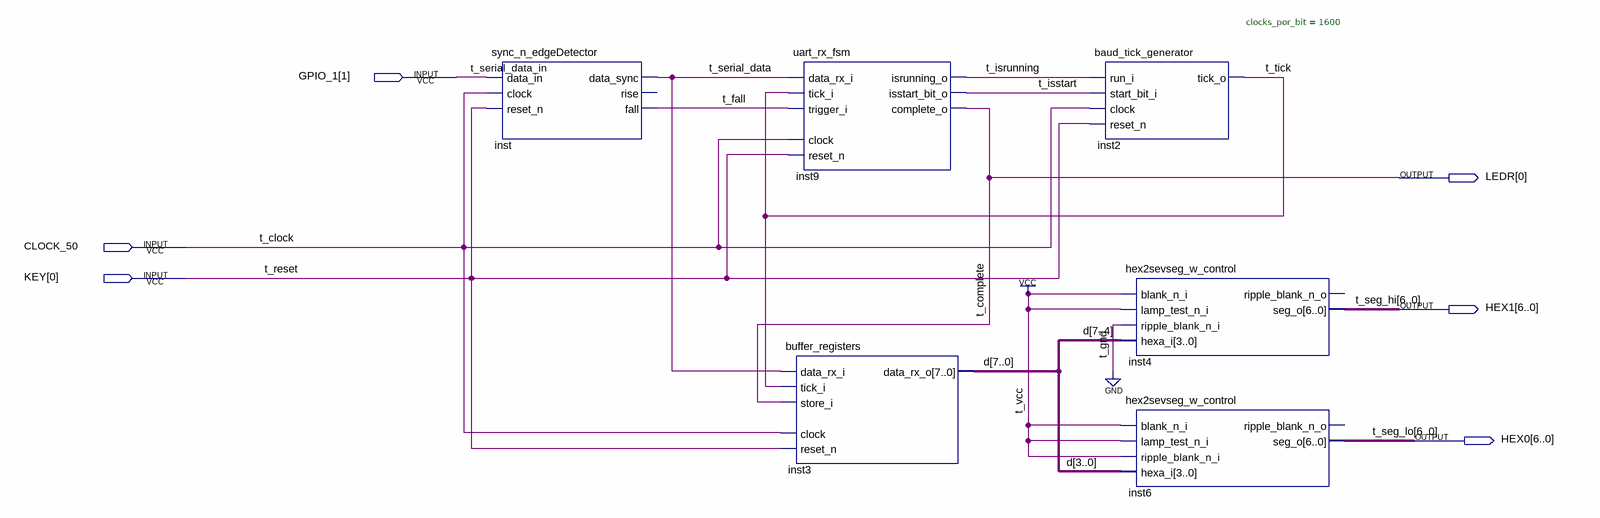
[diagram p0: schematic sheet]
// Quartus schematic UART_RX.bdf as structural Verilog: 6 symbols, 6 pins
module UART_RX (
  input  [1:1] GPIO_1,
  input  CLOCK_50,
  input  [0:0] KEY,
  output [0:0] LEDR,
  output [6:0] HEX1,
  output [6:0] HEX0
);

  wire t_fall, t_isrunning, t_isstart, t_serial_data, t_tick;
  wire [7:0] d;

  sync_n_edgeDetector inst (
    .data_in(GPIO_1[1]), .clock(CLOCK_50), .reset_n(KEY[0]), .data_sync(t_serial_data), .fall(t_fall));  // open: rise
  uart_rx_fsm inst9 (
    .clock(CLOCK_50), .reset_n(KEY[0]), .data_rx_i(t_serial_data), .trigger_i(t_fall), .tick_i(t_tick),
    .isrunning_o(t_isrunning), .isstart_bit_o(t_isstart), .complete_o(LEDR[0]));
  buffer_registers inst3 (
    .clock(CLOCK_50), .reset_n(KEY[0]), .data_rx_i(t_serial_data), .tick_i(t_tick), .store_i(LEDR[0]),
    .data_rx_o(d));
  baud_tick_generator #(.clocks_por_bit(1600)) inst2 (
    .reset_n(KEY[0]), .clock(CLOCK_50), .run_i(t_isrunning), .start_bit_i(t_isstart), .tick_o(t_tick));
  hex2sevseg_w_control inst4 (
    .blank_n_i(1'b1), .lamp_test_n_i(1'b1), .ripple_blank_n_i(1'b0), .hexa_i(d[7:4]), .seg_o(HEX1));  // open: ripple_blank_n_o
  hex2sevseg_w_control inst6 (
    .blank_n_i(1'b1), .lamp_test_n_i(1'b1), .ripple_blank_n_i(1'b1), .hexa_i(d[3:0]), .seg_o(HEX0));  // open: ripple_blank_n_o

  // Other names for the same wires on the sheet: t_complete = LEDR[0]; t_clock = CLOCK_50; t_reset = KEY[0];
  //   t_seg_hi[6:0] = HEX1; t_seg_lo[6:0] = HEX0; t_serial_data_in = GPIO_1[1]
endmodule
